# EAGLE schematic Schematic (EAGLE 9.6.2)
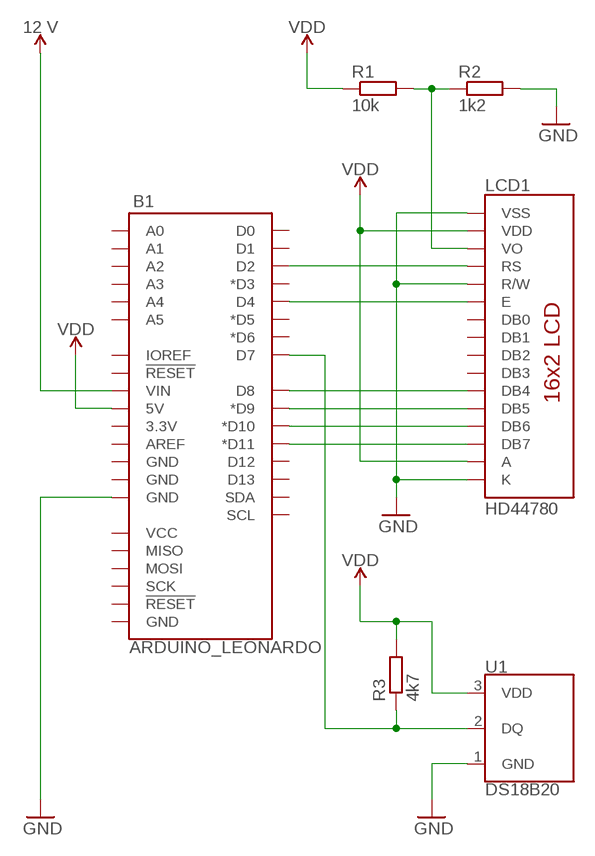
[diagram p0: schematic, sheet 1]

## Parts
B1  ARDUINO_LEONARDO  ARDUINO_UNO_R3  [ARDUINO_R3]
LCD1  HD44780  LCD-16X2NOSILK  [LCD-16X2_NOSILK]
R1  10k  R-EU_0204/7  [0204/7]
R2  1k2  R-EU_0204/7  [0204/7]
R3  4k7  R-EU_0204/7  [0204/7]
U1  DS18B20  [TO-92-AMMO]

## Nets
GND: B1.GND@2(GND) LCD1.1(VSS) LCD1.5(R/W) LCD1.16(K) R2.2 U1.1(GND)
N$1: B1.D2 LCD1.4(RS)
N$2: B1.D4 LCD1.6(E)
N$3: B1.D9(*D9) LCD1.12(DB5)
N$4: B1.D7 R3.1 U1.2(DQ)
N$5: B1.D8 LCD1.11(DB4)
N$8: B1.D10(*D10) LCD1.13(DB6)
N$9: B1.D11(*D11) LCD1.14(DB7)
N$11: LCD1.3(VO) R1.2 R2.1
VCC: B1.5V B1.VIN LCD1.2(VDD) LCD1.15(A) R1.1 R3.2 U1.3(VDD) ; supply symbol labelled 12 V, VDD
Unconnected: B1.3.3V B1.A0 B1.A1 B1.A2 B1.A3 B1.A4 B1.A5 B1.AREF B1.D0 B1.D1 B1.D3(*D3) B1.D5(*D5) B1.D6(*D6) B1.D12 B1.D13 B1.GND@1(GND) B1.GND@3(GND) B1.GND@4(GND) B1.IOREF B1.MISO B1.MOSI B1.RESET@1(!RESET!) B1.RESET@2(!RESET!) B1.SCK B1.SCL B1.SDA B1.VCC LCD1.7(DB0) LCD1.8(DB1) LCD1.9(DB2) LCD1.10(DB3)

## Library data of the parts
B1 = SparkFun-Boards:ARDUINO_UNO_R3: Arduino R3 Footprint with SPI header Arduino Uno R3 Compatible Footprint. Matches PCB size of the original board. SparkFun Products: SAMD21 Dev Breakout <https://www.sparkfun.com/products/13672> RedBoard <https://www.sparkfun.com/products/12757> R3 Stackable Headers <https://www.sparkfun.com/products/11417>
LCD1 = SparkFun-Displays:LCD-16X2: Standard text-only 16x2 parallel input LCD Basic 16 character by 2 line display. Typically utilizes the extremely common HD44780 parallel interface chipset SparkFun Products: Basic 16x2 Green <https://www.sparkfun.com/products/255> Basic 8x2 Green <https://www.sparkfun.com/products/11122>; SF_ID: LCD-00255
R1-R3 = rcl:R-EU_: RESISTOR, European symbol; SPICEPREFIX: R
U1 = SparkFun-Sensors:DS18B20: Dallas/Maxim DS18B20 1-Wire Temperature Sensor The DS18B20 reports degrees C with 9 to 12-bit precision, -55C to 125C (+/-0.5C). Each sensor has a unique 64-Bit Serial number etched into it - allows for a huge number of sensors to be used on one data bus. Datasheet <http://datasheets.maximintegrated.com/en/ds/DS18B20.pdf> SparkFun Products One Wire Digital Temperature Sensor - DS18B20 <https://www.sparkfun.com/products/245> (SEN-00245); STORE_ID: SEN-00245